# Altium project FlightControl.PrjPCB
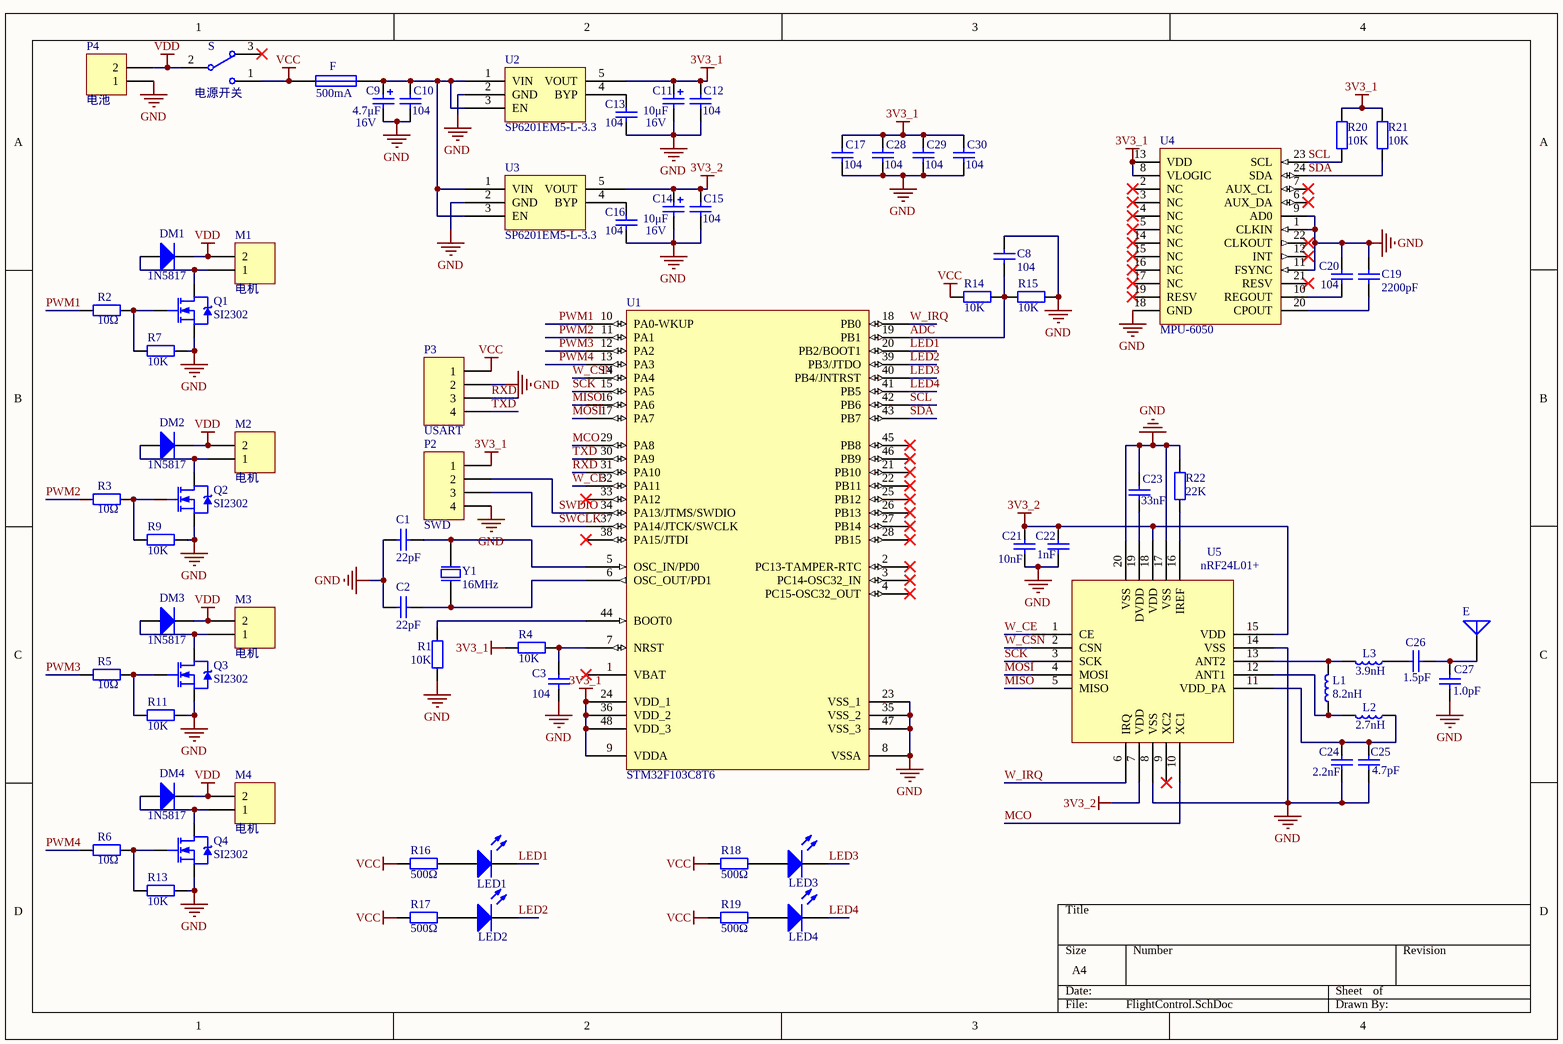
[diagram p0: FlightControl.SchDoc]
1 sheet, 75 parts. Net scope: global (net labels, ports and power ports of the same name join across sheets).
Board file: FlightControl.PcbDoc

## Sheet FlightControl.SchDoc
size A4

### Parts
C1  22pF  [CC1608-0603]
C2  22pF  [CC1608-0603]
C3  104  [CC1608-0603]
C8  104  [CC1608-0603]
C9  Voltage: 16V  [TAN-A-3216]  (hidden comment: 4.7μF)
C10  104  [CC1608-0603]
C11  Voltage: 16V  [TAN-A-3216]  (hidden comment: 10μF)
C12  104  [CC1608-0603]
C13  104  [CC1608-0603]
C14  Voltage: 16V  [TAN-A-3216]  (hidden comment: 10μF)
C15  104  [CC1608-0603]
C16  104  [CC1608-0603]
C17  104  [CC1608-0603]
C19  2200pF  [CC1608-0603]
C20  104  [CC1608-0603]
C21  10nF  [CC1608-0603]
C22  1nF  [CC1608-0603]
C23  33nF  [CC1608-0603]
C24  2.2nF  [CC1608-0603]
C25  4.7pF  [CC1608-0603]
C26  1.5pF  [CC1608-0603]
C27  1.0pF  [CC1608-0603]
C28  104  [CC1608-0603]
C29  104  [CC1608-0603]
C30  104  [CC1608-0603]
DM1  1N5817  [SOD-123 (1206)]
DM2  1N5817  [SOD-123 (1206)]
DM3  1N5817  [SOD-123 (1206)]
DM4  1N5817  [SOD-123 (1206)]
E  (no value)  [Chip Antenna]
F  500mA  [CR2012-0805]
L1  8.2nH  [CC1608[0603]]
L2  2.7nH  [CC1608[0603]]
L3  3.9nH  [CC1608[0603]]
LED1  LED Chip  [CLED2012-0805]  (value not drawn)
LED2  LED Chip  [CLED2012-0805]  (value not drawn)
LED3  LED Chip  [CLED2012-0805]  (value not drawn)
LED4  LED Chip  [CLED2012-0805]  (value not drawn)
M1  电机  [HDR1X2]
M2  电机  [HDR1X2]
M3  电机  [HDR1X2]
M4  电机  [HDR1X2]
P2  SWD  [HDR1X4]
P3  USART  [HDR1X4]
P4  电池  [HDR1X2]
Q1  SI2302  [SOT23]
Q2  SI2302  [SOT23]
Q3  SI2302  [SOT23]
Q4  SI2302  [SOT23]
R1  10K  [CR1608-0603]
R2  10Ω  [CR1608-0603]
R3  10Ω  [CR1608-0603]
R4  10K  [CR1608-0603]
R5  10Ω  [CR1608-0603]
R6  10Ω  [CR1608-0603]
R7  10K  [CR1608-0603]
R9  10K  [CR1608-0603]
R11  10K  [CR1608-0603]
R13  10K  [CR1608-0603]
R14  10K  [CR1608-0603]
R15  10K  [CR1608-0603]
R16  500Ω  [CR1608-0603]
R17  500Ω  [CR1608-0603]
R18  500Ω  [CR1608-0603]
R19  500Ω  [CR1608-0603]
R20  10K  [CR1608-0603]
R21  10K  [CR1608-0603]
R22  22K  [CR1608-0603]
S  电源开关  [MSK-12C02-1]
U1  STM32F103C8T6  [LQFP48_N]
U2  SP6201EM5-L-3.3  [SO-G5/NS]
U3  SP6201EM5-L-3.3  [SO-G5/NS]
U4  MPU-6050  [QFN50P400X400X95-24N]
U5  nRF24L01+  [QFN50P400X400-20V5N]
Y1  Frequency: 16MHz  [XTAL-PINGBI]  (hidden comment: 8MHz)

### Nets
3V3_1: C11.2 C12.2 C17.2 C28.2 C29.2 C30.2 P2.1 R4.1 R20.2 R21.2 U1.9(VDDA) U1.24(VDD_1) U1.36(VDD_2) U1.48(VDD_3) U2.5(VOUT) U4.8(VLOGIC) U4.13(VDD)
3V3_2: C14.2 C15.2 C21.1 C22.1 U3.5(VOUT) U5.7(VDD) U5.15(VDD) U5.18(VDD)
GND: C1.1 C2.1 C3.1 C8.1 C9.1 C10.1 C11.1 C12.1 C13.1 C14.1 C15.1 C16.1 C17.1 C19.1 C20.1 C21.2 C22.2 C23.1 C24.2 C25.2 C27.1 C28.1 C29.1 C30.1 P2.4 P3.2 P4.1 Q1.3(S) Q2.3(S) Q3.3(S) Q4.3(S) R1.1 R7.2 R9.2 R11.2 R13.2 R15.2 R22.2 U1.8(VSSA) U1.23(VSS_1) U1.35(VSS_2) U1.47(VSS_3) U2.2(GND) U3.2(GND) U4.1(CLKIN) U4.9(AD0) U4.11(FSYNC) U4.18(GND) U5.8(VSS) U5.14(VSS) U5.17(VSS) U5.20(VSS)
VCC: F.1 P3.1 R14.1 R16.1 R17.1 R18.1 R19.1 S.1
VDD: DM1.2(K) DM2.2(K) DM3.2(K) DM4.2(K) M1.2 M2.2 M3.2 M4.2 P4.2 S.2
ADC: C8.2 R14.2 R15.1 U1.19(PB1)
LED1: LED1.2(K) U1.20(PB2/BOOT1)
LED2: LED2.2(K) U1.39(PB3/JTDO)
LED3: LED3.2(K) U1.40(PB4/JNTRST)
LED4: LED4.2(K) U1.41(PB5)
MCO: U1.29(PA8) U5.10(XC1)
MISO: U1.16(PA6) U5.5(MISO)
MOSI: U1.17(PA7) U5.4(MOSI)
PWM1: R2.1 U1.10(PA0-WKUP)
PWM2: R3.1 U1.11(PA1)
PWM3: R5.1 U1.12(PA2)
PWM4: R6.1 U1.13(PA3)
RXD: P3.3 U1.31(PA10)
SCK: U1.15(PA5) U5.3(SCK)
SCL: R20.1 U1.42(PB6) U4.23(SCL)
SDA: R21.1 U1.43(PB7) U4.24(SDA)
SWCLK: P2.3 U1.37(PA14/JTCK/SWCLK)
SWDIO: P2.2 U1.34(PA13/JTMS/SWDIO)
TXD: P3.4 U1.30(PA9)
W_CE: U1.32(PA11) U5.1(CE)
W_CSN: U1.14(PA4) U5.2(CSN)
W_IRQ: U1.18(PB0) U5.6(IRQ)
NetC1_2: C1.2 U1.5(OSC_IN/PD0) Y1.2(OSC2)
NetC2_2: C2.2 U1.6(OSC_OUT/PD1) Y1.1(OSC1)
NetC3_2: C3.2 R4.2 U1.7(NRST)
NetC9_2: C9.2 C10.2 F.2 U2.1(VIN) U2.3(EN) U3.1(VIN) U3.3(EN)
NetC13_2: C13.2 U2.4(BYP)
NetC16_2: C16.2 U3.4(BYP)
NetC19_2: C19.2 U4.20(CPOUT)
NetC20_2: C20.2 U4.10(REGOUT)
NetC23_2: C23.2 U5.19(DVDD)
NetC24_1: C24.1 C25.1 L2.1 U5.11(VDD_PA)
NetC26_1: C26.1 L3.1
NetC26_2: C26.2 C27.2 E.1(A)
NetDM1_1: DM1.1(A) M1.1 Q1.2(D)
NetDM2_1: DM2.1(A) M2.1 Q2.2(D)
NetDM3_1: DM3.1(A) M3.1 Q3.2(D)
NetDM4_1: DM4.1(A) M4.1 Q4.2(D)
NetL1_1: L1.1 L2.2 U5.12(ANT1)
NetL1_2: L1.2 L3.2 U5.13(ANT2)
NetLED1_1: LED1.1(A) R16.2
NetLED2_1: LED2.1(A) R17.2
NetLED3_1: LED3.1(A) R18.2
NetLED4_1: LED4.1(A) R19.2
NetQ1_1: Q1.1(G) R2.2 R7.1
NetQ2_1: Q2.1(G) R3.2 R9.1
NetQ3_1: Q3.1(G) R5.2 R11.1
NetQ4_1: Q4.1(G) R6.2 R13.1
NetR1_2: R1.2 U1.44(BOOT0)
NetR22_1: R22.1 U5.16(IREF)

Not connected (* = marked no-connect by the designer): S 3*; U1 1(VBAT)* 2(PC13-TAMPER-RTC)* 3(PC14-OSC32_IN)* 4(PC15-OSC32_OUT)* 21(PB10)* 22(PB11)* 25(PB12)* 26(PB13)* 27(PB14)* 28(PB15)* 33(PA12)* 38(PA15/JTDI)* 45(PB8)* 46(PB9)*; U4 2(NC)* 3(NC)* 4(NC)* 5(NC)* 6(AUX_DA)* 7(AUX_CL)* 12(INT)* 14(NC)* 15(NC)* 16(NC)* 17(NC)* 19(RESV)* 21(RESV)* 22(CLKOUT)*; U5 9(XC2)*

### Library data of the parts
C1-C3 C8 C10 C12 C13 C15-C17 C19-C30 = Cap: Capacitor; Published: 8-Jun-2000; LatestRevisionDate: 17-Jul-2002; LatestRevisionNote: Re-released for DXP Platform.; PackageReference: RAD-0.3; Publisher: Altium Limited; PackageDescription: Radial Cap, Thru-Hole; 2 Leads; 0.3 in Pin Spacing
  C1 C2: Value: 22pF
  C3 C8 C10 C12 C13 C15-C17 C20 C28-C30: Value: 104
  C19: Value: 2200pF
  C21: Value: 10nF
  C22: Value: 1nF
  C23: Value: 33nF
  C24: Value: 2.2nF
  C25: Value: 4.7pF
  C26: Value: 1.5pF
  C27: Value: 1.0pF
C9 C11 C14 = Cap Tan: Polarized Capacitor (Radial); Published: 8-Jun-2000; Revision: July-2002: Re-released for DXP Platform.; Publisher: Altium Limited
  C9: Value: 4.7μF
  C11 C14: Value: 10μF
DM1-DM4 = 二极管  SOD-323
E = Antenna: Generic Antenna; Published: 24-Mar-1999; LatestRevisionDate: 17-Jul-2002; LatestRevisionNote: Re-released for DXP Platform.; PackageReference: PIN1; Publisher: Altium Limited
F = Fuse: Published: 8-Jun-2000; Revision: July-2002: Re-released for DXP Platform.; Publisher: Altium Limited
L1-L3 = Inductor: Code_IEC: 1005; Published: 8-Jun-2000; LatestRevisionDate: 29-May-2009; LatestRevisionNote: IPC-7351 Footprint Added.; PackageReference: 0402-A; Publisher: Altium Limited; PackageDescription: Chip Inductor; Code_JEITA: 0402
  L1: Value: 8.2nH
  L2: Value: 2.7nH
  L3: Value: 3.9nH
LED1-LED4 = LED Chip: Typical Chip LED; Published: 8-Jun-2000; Revision: July-2002: Re-released for DXP Platform.; Publisher: Altium Limited
M1-M4 P4 = Header 2: Header, 2-Pin; LatestRevisionDate: 17-Jul-2002; LatestRevisionNote: Re-released for DXP Platform.; Publisher: Altium Limited
P2 P3 = Header 4: Header, 4-Pin; LatestRevisionDate: 17-Jul-2002; LatestRevisionNote: Re-released for DXP Platform.; Publisher: Altium Limited
Q1-Q4 = NMOS: N-Channel Power MOSFET; Note: Pin 2 is electrically connected to pin 4.; Published: 8-Jun-2000; LatestRevisionDate: 17-Jul-2002; LatestRevisionNote: Re-released for DXP Platform.; DatasheetVersion: PD-9.814; PackageVersion: Feb-1997; PackageReference: TO-220AB; Publisher: Altium Limited; PackageDescription: TO, Thru-Hole, Vertical, Heatsink Mounted; 3 In-Line Leads; Pitch 2.54 mm; ComponentLink1Description: Manufacturer Link; ComponentLink1URL: http://www.irf.com/
R1-R7 R9 R11 R13-R22 = Resistor Chip: Resistor; Published: 8-Jun-2000; Revision: July-2002: Re-released for DXP Platform.; Publisher: Altium Limited
  R1 R4 R7 R9 R11 R13-R15 R20 R21: Value: 10K
  R2 R3 R5 R6: Value: 10Ω
  R16-R19: Value: 500Ω
  R22: Value: 22K
S = SW-SPDT: SPDT Subminiature Toggle Switch, Right Angle Mounting, Vertical Actuation; Published: 24-Mar-1999; LatestRevisionDate: 17-Dec-2003; LatestRevisionNote: Schematic revised, PCB Footprint replaced.; DatasheetVersion: 05-Dec-2000; PackageReference: TL36WW15050; Publisher: Altium Limited; PackageDescription: Switch; 4 Leads; ComponentLink1Description: Manufacturer Link; ComponentLink1URL: http://www.apem.com
U1 = STM32F103C8T6: STM32 ARM-based 32-bit MCU with 64 Kbytes Flash, 48-pin LQFP, Industrial Temperature; Published: *; DatasheetVersion: *; PackageVersion: *; PackageReference: *; Publisher: *; PackageDescription: *; ComponentLink1Description: *; ComponentLink1URL: *; ComponentLink2Description: *; ComponentLink2URL: *
U2 U3 = PAM3101
U4 = MPU-6050: 3-axis gyroscope and 3-axis accelerometer
Y1 = XTAL: Crystal Oscillator; Published: 8-Jun-2000; Revision: July-2002: Re-released for DXP Platform.; Publisher: Altium Limited